# Altium schematic sheet sdram.SchDoc: DDR3 SDRAM
size D; CheckedBy: J. Brinton; CompanyName: Signal Laboratories, Inc.; DrawnBy: J. Brinton; Engineer: J. Brinton; Address1: 3479 Edison Way; Address2: Menlo Park CA 94025; Address3: +1 (877) 778-8435; Address4: siglabs.com; DocumentNumber: 39; Revision: 2b; SheetNumber: 40; SheetTotal: 58
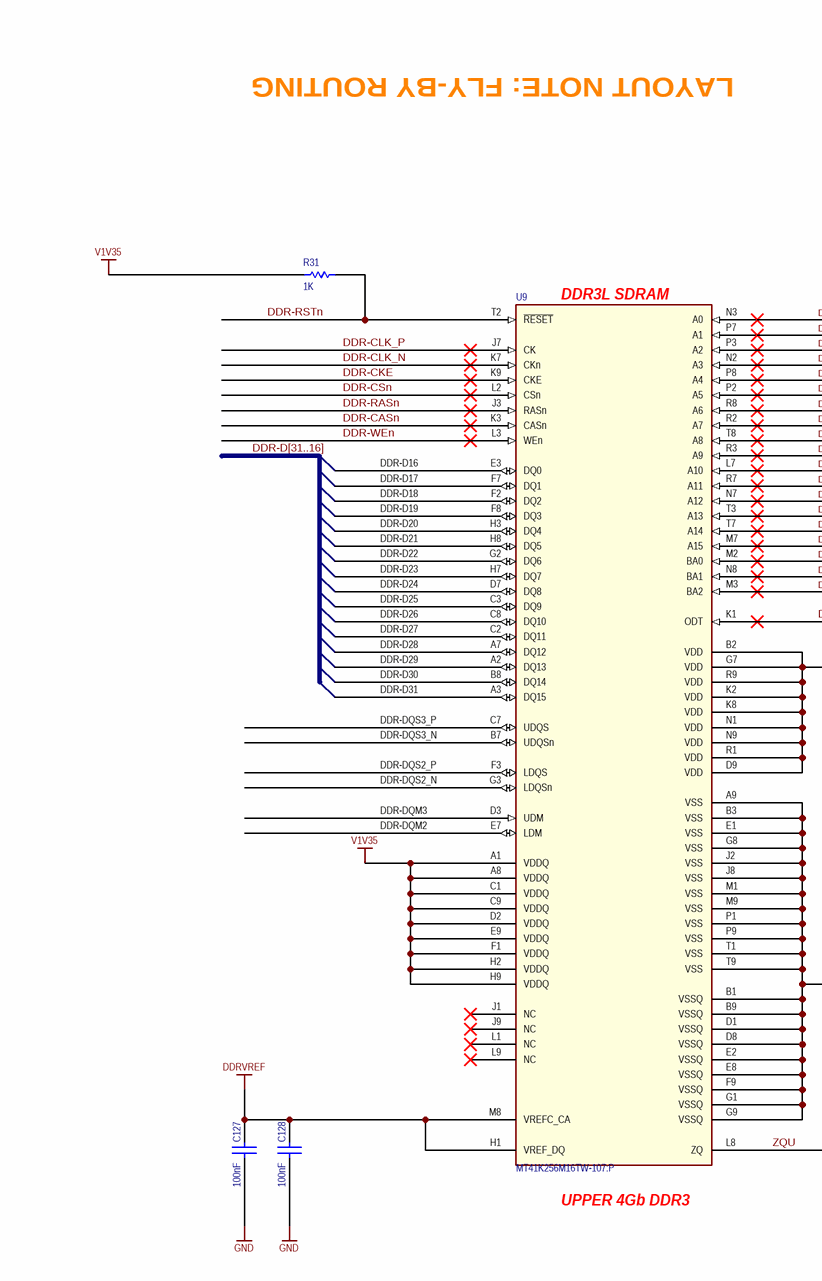
[diagram p0: sdram.SchDoc, top left]
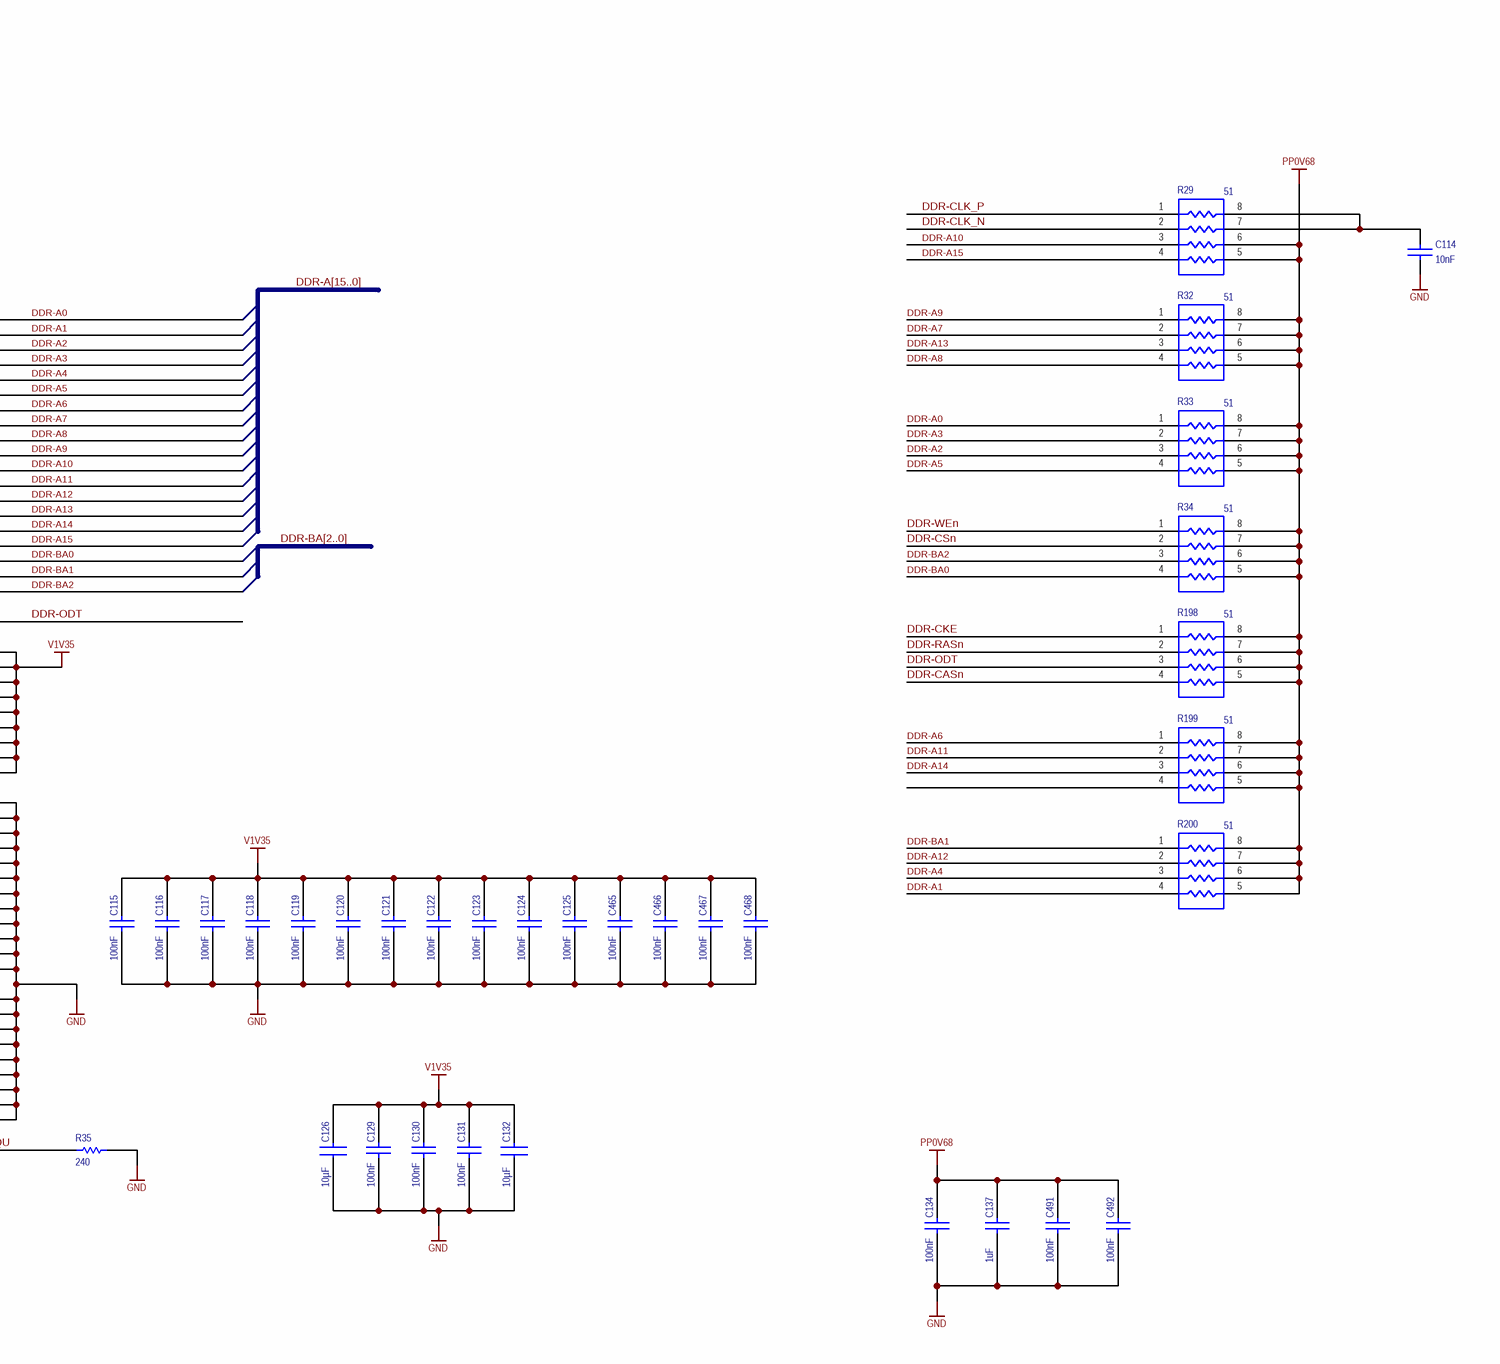
[diagram p1: sdram.SchDoc, top right]
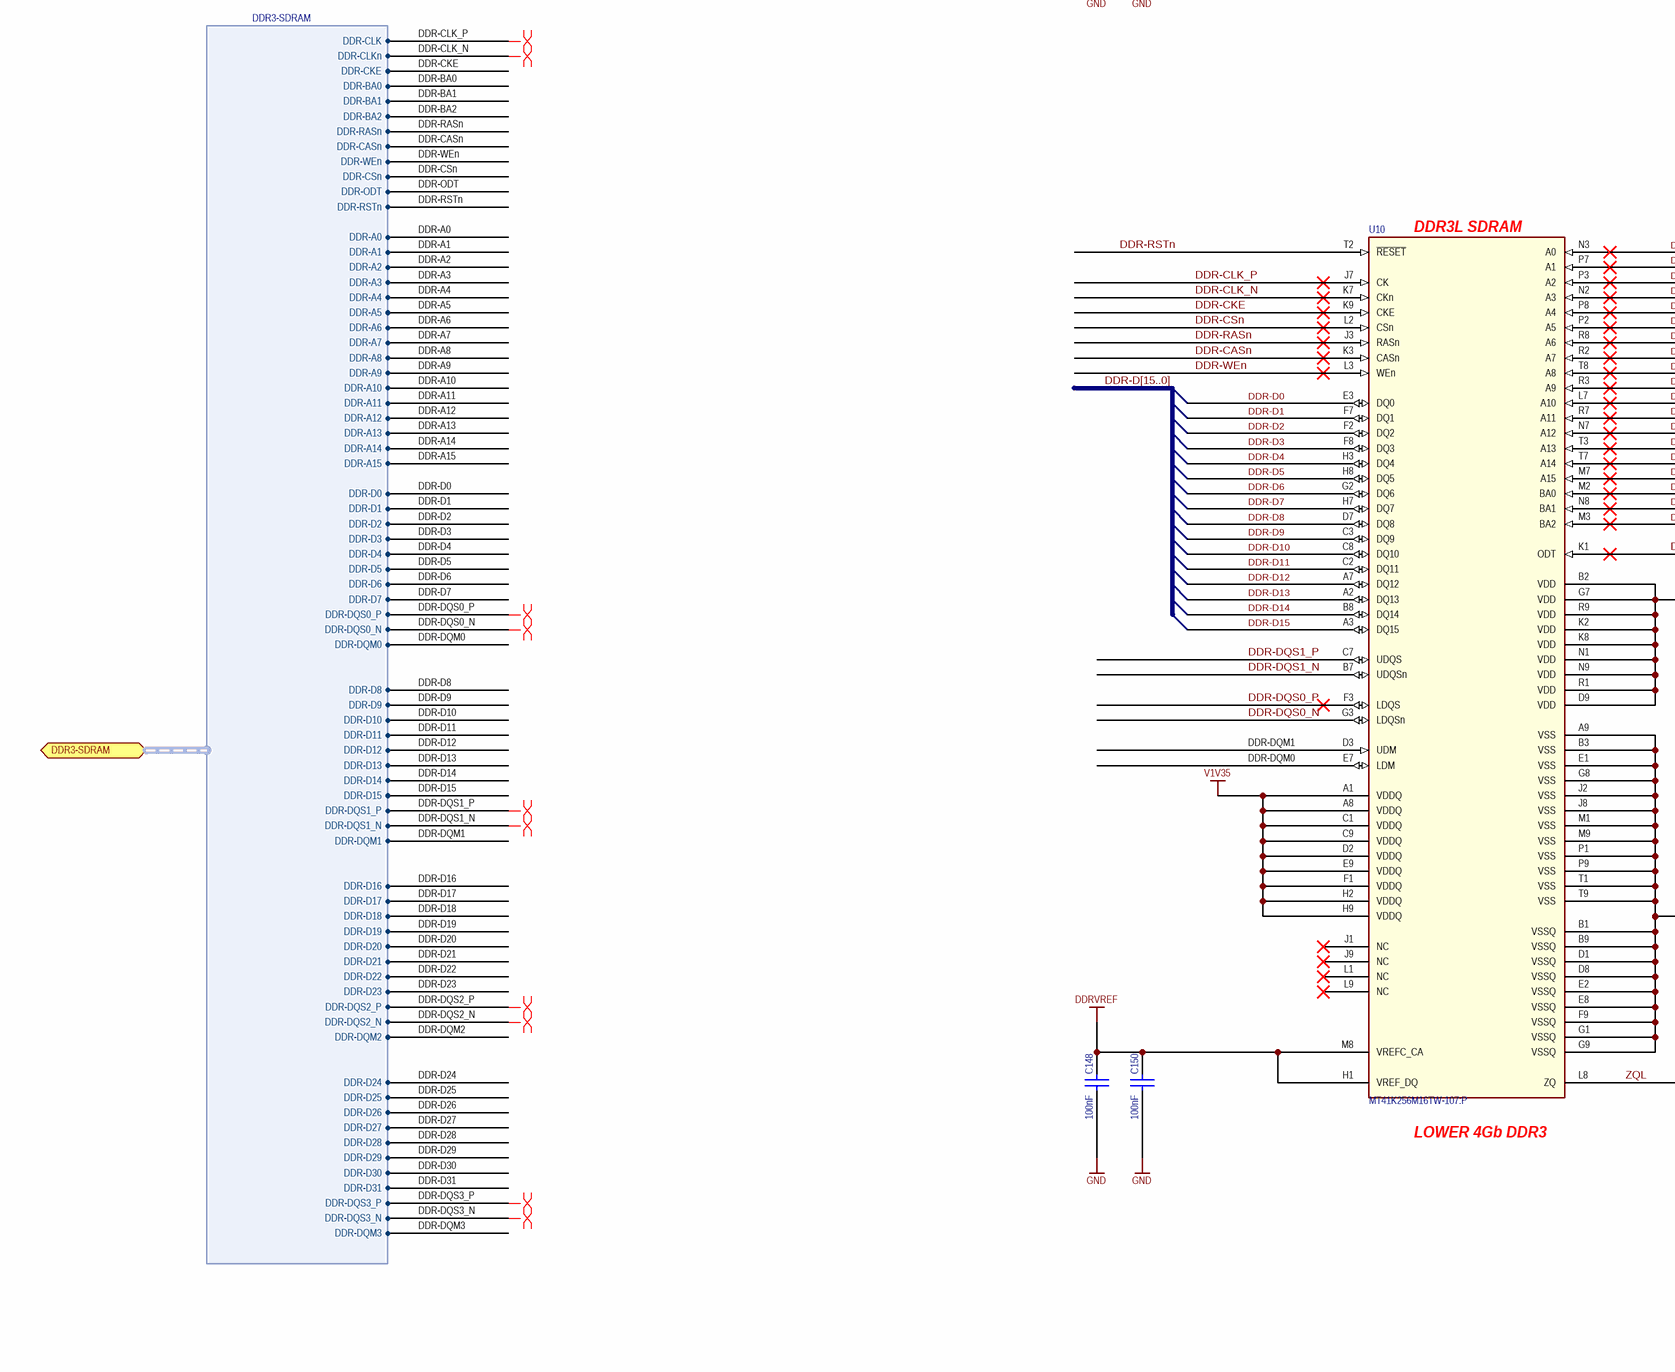
[diagram p2: sdram.SchDoc, bottom left]
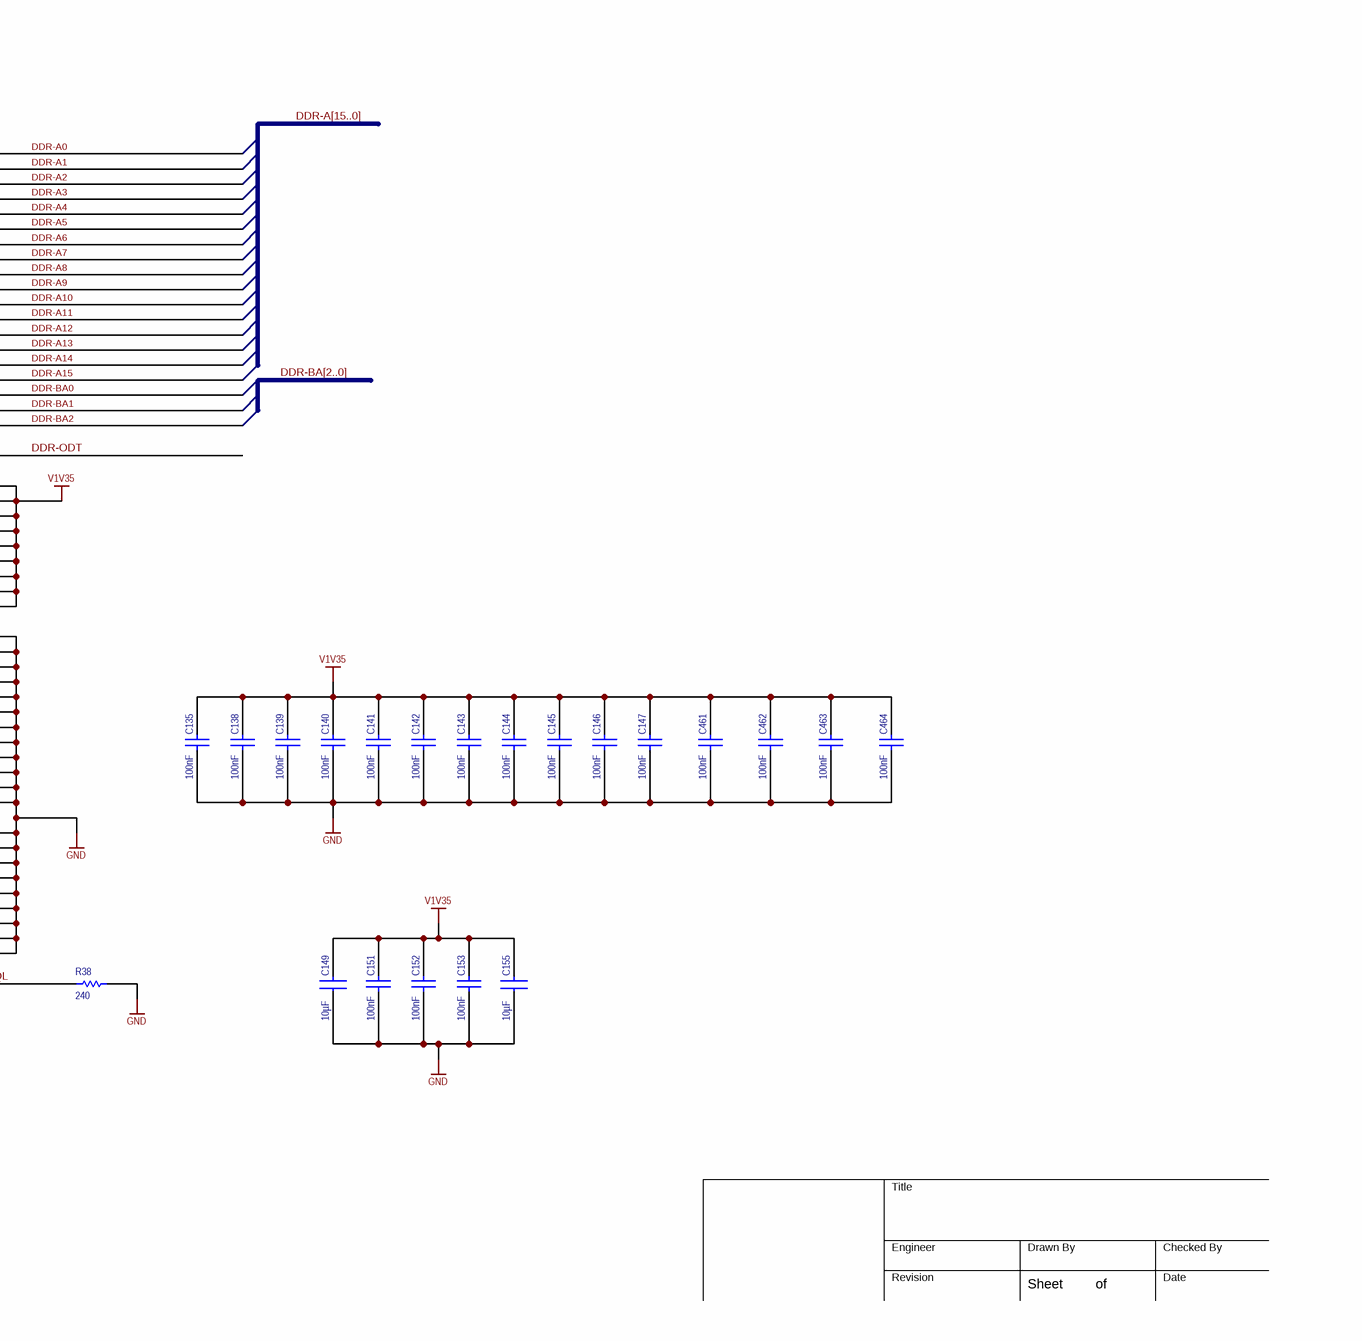
[diagram p3: sdram.SchDoc, bottom right]

## Parts
C114  value 10nF  [0402]  (hidden comment: GRM155R71E103KA01D)
C115  value 100nF  [CAPC1005X56N]  (hidden comment: GRM155R71C104KA88J)
C116  value 100nF  [CAPC1005X56N]  (hidden comment: GRM155R71C104KA88J)
C117  value 100nF  [CAPC1005X56N]  (hidden comment: GRM155R71C104KA88J)
C118  value 100nF  [CAPC1005X56N]  (hidden comment: GRM155R71C104KA88J)
C119  value 100nF  [CAPC1005X56N]  (hidden comment: GRM155R71C104KA88J)
C120  value 100nF  [CAPC1005X56N]  (hidden comment: GRM155R71C104KA88J)
C121  value 100nF  [CAPC1005X56N]  (hidden comment: GRM155R71C104KA88J)
C122  value 100nF  [CAPC1005X56N]  (hidden comment: GRM155R71C104KA88J)
C123  value 100nF  [CAPC1005X56N]  (hidden comment: GRM155R71C104KA88J)
C124  value 100nF  [CAPC1005X56N]  (hidden comment: GRM155R71C104KA88J)
C125  value 100nF  [CAPC1005X56N]  (hidden comment: GRM155R71C104KA88J)
C126  value 10µF  [0603]  (hidden comment: CL10A106MA8NRNC)
C127  value 100nF  [CAPC1005X56N]  (hidden comment: GRM155R71C104KA88J)
C128  value 100nF  [CAPC1005X56N]  (hidden comment: GRM155R71C104KA88J)
C129  value 100nF  [CAPC1005X56N]  (hidden comment: GRM155R71C104KA88J)
C130  value 100nF  [CAPC1005X56N]  (hidden comment: GRM155R71C104KA88J)
C131  value 100nF  [CAPC1005X56N]  (hidden comment: GRM155R71C104KA88J)
C132  value 10µF  [0603]  (hidden comment: CL10A106MA8NRNC)
C134  value 100nF  [CAPC1005X56N]  (hidden comment: GRM155R71C104KA88J)
C135  value 100nF  [CAPC1005X56N]  (hidden comment: GRM155R71C104KA88J)
C137  value 1uF  [CAPC1005X56N]  (hidden comment: GRM155R61A105KE15D)
C138  value 100nF  [CAPC1005X56N]  (hidden comment: GRM155R71C104KA88J)
C139  value 100nF  [CAPC1005X56N]  (hidden comment: GRM155R71C104KA88J)
C140  value 100nF  [CAPC1005X56N]  (hidden comment: GRM155R71C104KA88J)
C141  value 100nF  [CAPC1005X56N]  (hidden comment: GRM155R71C104KA88J)
C142  value 100nF  [CAPC1005X56N]  (hidden comment: GRM155R71C104KA88J)
C143  value 100nF  [CAPC1005X56N]  (hidden comment: GRM155R71C104KA88J)
C144  value 100nF  [CAPC1005X56N]  (hidden comment: GRM155R71C104KA88J)
C145  value 100nF  [CAPC1005X56N]  (hidden comment: GRM155R71C104KA88J)
C146  value 100nF  [CAPC1005X56N]  (hidden comment: GRM155R71C104KA88J)
C147  value 100nF  [CAPC1005X56N]  (hidden comment: GRM155R71C104KA88J)
C148  value 100nF  [CAPC1005X56N]  (hidden comment: GRM155R71C104KA88J)
C149  value 10µF  [0603]  (hidden comment: CL10A106MA8NRNC)
C150  value 100nF  [CAPC1005X56N]  (hidden comment: GRM155R71C104KA88J)
C151  value 100nF  [CAPC1005X56N]  (hidden comment: GRM155R71C104KA88J)
C152  value 100nF  [CAPC1005X56N]  (hidden comment: GRM155R71C104KA88J)
C153  value 100nF  [CAPC1005X56N]  (hidden comment: GRM155R71C104KA88J)
C155  value 10µF  [0603]  (hidden comment: CL10A106MA8NRNC)
C461  value 100nF  [CAPC1005X56N]  (hidden comment: GRM155R71C104KA88J)
C462  value 100nF  [CAPC1005X56N]  (hidden comment: GRM155R71C104KA88J)
C463  value 100nF  [CAPC1005X56N]  (hidden comment: GRM155R71C104KA88J)
C464  value 100nF  [CAPC1005X56N]  (hidden comment: GRM155R71C104KA88J)
C465  value 100nF  [CAPC1005X56N]  (hidden comment: GRM155R71C104KA88J)
C466  value 100nF  [CAPC1005X56N]  (hidden comment: GRM155R71C104KA88J)
C467  value 100nF  [CAPC1005X56N]  (hidden comment: GRM155R71C104KA88J)
C468  value 100nF  [CAPC1005X56N]  (hidden comment: GRM155R71C104KA88J)
C491  value 100nF  [CAPC1005X56N]  (hidden comment: GRM155R71C104KA88J)
C492  value 100nF  [CAPC1005X56N]  (hidden comment: GRM155R71C104KA88J)
R29  value 51  [0804-PAK-8]  (hidden comment: 741C083510JP)
R31  value 1K  [0402]  (hidden comment: RC0402FR-071KL)
R32  value 51  [0804-PAK-8]  (hidden comment: 741C083510JP)
R33  value 51  [0804-PAK-8]  (hidden comment: 741C083510JP)
R34  value 51  [0804-PAK-8]  (hidden comment: 741C083510JP)
R35  value 240  [0402]  (hidden comment: ERJ-2RKF2400X)
R38  value 240  [0402]  (hidden comment: ERJ-2RKF2400X)
R198  value 51  [0804-PAK-8]  (hidden comment: 741C083510JP)
R199  value 51  [0804-PAK-8]  (hidden comment: 741C083510JP)
R200  value 51  [0804-PAK-8]  (hidden comment: 741C083510JP)
U9  MT41K256M16TW-107:P  [BGA96_T9_P8_9X14]
U10  MT41K256M16TW-107:P  [BGA96_T9_P8_9X14]

## Ports
DDR3-SDRAM (harness DDR3-SDRAM)

## Harnesses
DDR3-SDRAM: DDR-CLK, DDR-CLKn, DDR-CKE, DDR-BA0, DDR-BA1, DDR-BA2, DDR-RASn, DDR-CASn, DDR-WEn, DDR-CSn, DDR-ODT, DDR-RSTn, DDR-A0, DDR-A1, DDR-A2, DDR-A3, DDR-A4, DDR-A5, DDR-A6, DDR-A7, DDR-A8, DDR-A9, DDR-A10, DDR-A11, DDR-A12, DDR-A13, DDR-A14, DDR-A15, DDR-D0, DDR-D1, DDR-D2, DDR-D3, DDR-D4, DDR-D5, DDR-D6, DDR-D7, DDR-DQM0, DDR-DQS0_P, DDR-DQS0_N, DDR-D8, DDR-D9, DDR-D10, DDR-D11, DDR-D12, DDR-D13, DDR-D14, DDR-D15, DDR-DQM1, DDR-DQS1_P, DDR-DQS1_N, DDR-D16, DDR-D17, DDR-D18, DDR-D19, DDR-D20, DDR-D21, DDR-D22, DDR-D23, DDR-DQM2, DDR-DQS2_P, DDR-DQS2_N, DDR-D24, DDR-D25, DDR-D26, DDR-D27, DDR-D28, DDR-D29, DDR-D30, DDR-D31, DDR-DQM3, DDR-DQS3_P, DDR-DQS3_N

## Nets
DDRVREF: C127.2 C128.2 C148.2 C150.2 U9.H1(VREF_DQ) U9.M8(VREFC_CA) U10.H1(VREF_DQ) U10.M8(VREFC_CA)
GND: C114.1 C115.1 C116.1 C117.1 C118.1 C119.1 C120.1 C121.1 C122.1 C123.1 C124.1 C125.1 C126.1 C127.1 C128.1 C129.1 C130.1 C131.1 C132.1 C134.1 C135.1 C137.1 C138.1 C139.1 C140.1 C141.1 C142.1 C143.1 C144.1 C145.1 C146.1 C147.1 C148.1 C149.1 C150.1 C151.1 C152.1 C153.1 C155.1 C461.1 C462.1 C463.1 C464.1 C465.1 C466.1 C467.1 C468.1 C491.1 C492.1 R35.2 R38.2 U9.A9(VSS) U9.B1(VSSQ) U9.B3(VSS) U9.B9(VSSQ) U9.D1(VSSQ) U9.D8(VSSQ) U9.E1(VSS) U9.E2(VSSQ) U9.E8(VSSQ) U9.F9(VSSQ) U9.G1(VSSQ) U9.G8(VSS) U9.G9(VSSQ) U9.J2(VSS) U9.J8(VSS) U9.M1(VSS) U9.M9(VSS) U9.P1(VSS) U9.P9(VSS) U9.T1(VSS) U9.T9(VSS) U10.A9(VSS) U10.B1(VSSQ) U10.B3(VSS) U10.B9(VSSQ) U10.D1(VSSQ) U10.D8(VSSQ) U10.E1(VSS) U10.E2(VSSQ) U10.E8(VSSQ) U10.F9(VSSQ) U10.G1(VSSQ) U10.G8(VSS) U10.G9(VSSQ) U10.J2(VSS) U10.J8(VSS) U10.M1(VSS) U10.M9(VSS) U10.P1(VSS) U10.P9(VSS) U10.T1(VSS) U10.T9(VSS)
PP0V68: C134.2 C137.2 C491.2 C492.2 R29.5 R29.6 R32.5 R32.6 R32.7 R32.8 R33.5 R33.6 R33.7 R33.8 R34.5 R34.6 R34.7 R34.8 R198.5 R198.6 R198.7 R198.8 R199.5 R199.6 R199.7 R199.8 R200.5 R200.6 R200.7 R200.8
V1V35: C115.2 C116.2 C117.2 C118.2 C119.2 C120.2 C121.2 C122.2 C123.2 C124.2 C125.2 C126.2 C129.2 C130.2 C131.2 C132.2 C135.2 C138.2 C139.2 C140.2 C141.2 C142.2 C143.2 C144.2 C145.2 C146.2 C147.2 C149.2 C151.2 C152.2 C153.2 C155.2 C461.2 C462.2 C463.2 C464.2 C465.2 C466.2 C467.2 C468.2 R31.1 U9.A1(VDDQ) U9.A8(VDDQ) U9.B2(VDD) U9.C1(VDDQ) U9.C9(VDDQ) U9.D2(VDDQ) U9.D9(VDD) U9.E9(VDDQ) U9.F1(VDDQ) U9.G7(VDD) U9.H2(VDDQ) U9.H9(VDDQ) U9.K2(VDD) U9.K8(VDD) U9.N1(VDD) U9.N9(VDD) U9.R1(VDD) U9.R9(VDD) U10.A1(VDDQ) U10.A8(VDDQ) U10.B2(VDD) U10.C1(VDDQ) U10.C9(VDDQ) U10.D2(VDDQ) U10.D9(VDD) U10.E9(VDDQ) U10.F1(VDDQ) U10.G7(VDD) U10.H2(VDDQ) U10.H9(VDDQ) U10.K2(VDD) U10.K8(VDD) U10.N1(VDD) U10.N9(VDD) U10.R1(VDD) U10.R9(VDD)
DDR-A0: R33.1 U9.N3(A0) U10.N3(A0) ; port DDR3-SDRAM.DDR-A0
DDR-A1: R200.4 U9.P7(A1) U10.P7(A1) ; port DDR3-SDRAM.DDR-A1
DDR-A2: R33.3 U9.P3(A2) U10.P3(A2) ; port DDR3-SDRAM.DDR-A2
DDR-A3: R33.2 U9.N2(A3) U10.N2(A3) ; port DDR3-SDRAM.DDR-A3
DDR-A4: R200.3 U9.P8(A4) U10.P8(A4) ; port DDR3-SDRAM.DDR-A4
DDR-A5: R33.4 U9.P2(A5) U10.P2(A5) ; port DDR3-SDRAM.DDR-A5
DDR-A6: R199.1 U9.R8(A6) U10.R8(A6) ; port DDR3-SDRAM.DDR-A6
DDR-A7: R32.2 U9.R2(A7) U10.R2(A7) ; port DDR3-SDRAM.DDR-A7
DDR-A8: R32.4 U9.T8(A8) U10.T8(A8) ; port DDR3-SDRAM.DDR-A8
DDR-A9: R32.1 U9.R3(A9) U10.R3(A9) ; port DDR3-SDRAM.DDR-A9
DDR-A10: R29.3 U9.L7(A10) U10.L7(A10) ; port DDR3-SDRAM.DDR-A10
DDR-A11: R199.2 U9.R7(A11) U10.R7(A11) ; port DDR3-SDRAM.DDR-A11
DDR-A12: R200.2 U9.N7(A12) U10.N7(A12) ; port DDR3-SDRAM.DDR-A12
DDR-A13: R32.3 U9.T3(A13) U10.T3(A13) ; port DDR3-SDRAM.DDR-A13
DDR-A14: R199.3 U9.T7(A14) U10.T7(A14) ; port DDR3-SDRAM.DDR-A14
DDR-A15: R29.4 U9.M7(A15) U10.M7(A15) ; port DDR3-SDRAM.DDR-A15
DDR-BA0: R34.4 U9.M2(BA0) U10.M2(BA0) ; port DDR3-SDRAM.DDR-BA0
DDR-BA1: R200.1 U9.N8(BA1) U10.N8(BA1) ; port DDR3-SDRAM.DDR-BA1
DDR-BA2: R34.3 U9.M3(BA2) U10.M3(BA2) ; port DDR3-SDRAM.DDR-BA2
DDR-CASn: R198.4 U9.K3(CASn) U10.K3(CASn) ; port DDR3-SDRAM.DDR-CASn
DDR-CKE: R198.1 U9.K9(CKE) U10.K9(CKE) ; port DDR3-SDRAM.DDR-CKE
DDR-CLK_N: R29.2 U9.K7(CKn) U10.K7(CKn) ; port DDR3-SDRAM.DDR-CLKn
DDR-CLK_P: R29.1 U9.J7(CK) U10.J7(CK) ; port DDR3-SDRAM.DDR-CLK
DDR-CSn: R34.2 U9.L2(CSn) U10.L2(CSn) ; port DDR3-SDRAM.DDR-CSn
DDR-D0: U10.E3(DQ0) ; port DDR3-SDRAM.DDR-D0
DDR-D1: U10.F7(DQ1) ; port DDR3-SDRAM.DDR-D1
DDR-D2: U10.F2(DQ2) ; port DDR3-SDRAM.DDR-D2
DDR-D3: U10.F8(DQ3) ; port DDR3-SDRAM.DDR-D3
DDR-D4: U10.H3(DQ4) ; port DDR3-SDRAM.DDR-D4
DDR-D5: U10.H8(DQ5) ; port DDR3-SDRAM.DDR-D5
DDR-D6: U10.G2(DQ6) ; port DDR3-SDRAM.DDR-D6
DDR-D7: U10.H7(DQ7) ; port DDR3-SDRAM.DDR-D7
DDR-D8: U10.D7(DQ8) ; port DDR3-SDRAM.DDR-D8
DDR-D9: U10.C3(DQ9) ; port DDR3-SDRAM.DDR-D9
DDR-D10: U10.C8(DQ10) ; port DDR3-SDRAM.DDR-D10
DDR-D11: U10.C2(DQ11) ; port DDR3-SDRAM.DDR-D11
DDR-D12: U10.A7(DQ12) ; port DDR3-SDRAM.DDR-D12
DDR-D13: U10.A2(DQ13) ; port DDR3-SDRAM.DDR-D13
DDR-D14: U10.B8(DQ14) ; port DDR3-SDRAM.DDR-D14
DDR-D15: U10.A3(DQ15) ; port DDR3-SDRAM.DDR-D15
DDR-D16: U9.E3(DQ0) ; port DDR3-SDRAM.DDR-D16
DDR-D17: U9.F7(DQ1) ; port DDR3-SDRAM.DDR-D17
DDR-D18: U9.F2(DQ2) ; port DDR3-SDRAM.DDR-D18
DDR-D19: U9.F8(DQ3) ; port DDR3-SDRAM.DDR-D19
DDR-D20: U9.H3(DQ4) ; port DDR3-SDRAM.DDR-D20
DDR-D21: U9.H8(DQ5) ; port DDR3-SDRAM.DDR-D21
DDR-D22: U9.G2(DQ6) ; port DDR3-SDRAM.DDR-D22
DDR-D23: U9.H7(DQ7) ; port DDR3-SDRAM.DDR-D23
DDR-D24: U9.D7(DQ8) ; port DDR3-SDRAM.DDR-D24
DDR-D25: U9.C3(DQ9) ; port DDR3-SDRAM.DDR-D25
DDR-D26: U9.C8(DQ10) ; port DDR3-SDRAM.DDR-D26
DDR-D27: U9.C2(DQ11) ; port DDR3-SDRAM.DDR-D27
DDR-D28: U9.A7(DQ12) ; port DDR3-SDRAM.DDR-D28
DDR-D29: U9.A2(DQ13) ; port DDR3-SDRAM.DDR-D29
DDR-D30: U9.B8(DQ14) ; port DDR3-SDRAM.DDR-D30
DDR-D31: U9.A3(DQ15) ; port DDR3-SDRAM.DDR-D31
DDR-DQM0: U10.E7(LDM) ; port DDR3-SDRAM.DDR-DQM0
DDR-DQM1: U10.D3(UDM) ; port DDR3-SDRAM.DDR-DQM1
DDR-DQM2: U9.E7(LDM) ; port DDR3-SDRAM.DDR-DQM2
DDR-DQM3: U9.D3(UDM) ; port DDR3-SDRAM.DDR-DQM3
DDR-DQS0_N: U10.G3(LDQSn) ; port DDR3-SDRAM.DDR-DQS0_N
DDR-DQS0_P: U10.F3(LDQS) ; port DDR3-SDRAM.DDR-DQS0_P
DDR-DQS1_N: U10.B7(UDQSn) ; port DDR3-SDRAM.DDR-DQS1_N
DDR-DQS1_P: U10.C7(UDQS) ; port DDR3-SDRAM.DDR-DQS1_P
DDR-DQS2_N: U9.G3(LDQSn) ; port DDR3-SDRAM.DDR-DQS2_N
DDR-DQS2_P: U9.F3(LDQS) ; port DDR3-SDRAM.DDR-DQS2_P
DDR-DQS3_N: U9.B7(UDQSn) ; port DDR3-SDRAM.DDR-DQS3_N
DDR-DQS3_P: U9.C7(UDQS) ; port DDR3-SDRAM.DDR-DQS3_P
DDR-ODT: R198.3 U9.K1(ODT) U10.K1(ODT) ; port DDR3-SDRAM.DDR-ODT
DDR-RASn: R198.2 U9.J3(RASn) U10.J3(RASn) ; port DDR3-SDRAM.DDR-RASn
DDR-RSTn: R31.2 U9.T2(~{RESET}) U10.T2(~{RESET}) ; port DDR3-SDRAM.DDR-RSTn
DDR-WEn: R34.1 U9.L3(WEn) U10.L3(WEn) ; port DDR3-SDRAM.DDR-WEn
ZQL: R38.1 U10.L8(ZQ)
ZQU: R35.1 U9.L8(ZQ)
NetC114_2: C114.2 R29.7 R29.8

Not connected (* = marked no-connect by the designer): R199 4; U9 J1(NC)* J9(NC)* L1(NC)* L9(NC)*; U10 J1(NC)* J9(NC)* L1(NC)* L9(NC)*

## Buses and harness runs
bus DDR-A[15..0]
bus DDR-BA[2..0]
bus DDR-D[15..0]
bus DDR-D[31..16]

## Layout directives
differential pair: DDR-CLK_N, DDR-CLK_P, DDR-DQS0_N, DDR-DQS0_P, DDR-DQS1_N, DDR-DQS1_P, DDR-DQS2_N, DDR-DQS2_P, DDR-DQS3_N, DDR-DQS3_P

## Notes on the sheet
- LAYOUT NOTE: FLY-BY ROUTING
- (near U9) DDR3L SDRAM
- (near U9) UPPER 4Gb DDR3
- (near U10) DDR3L SDRAM
- (near U10) LOWER 4Gb DDR3
- Title
- Engineer
- Revision
- Drawn By
- Sheet
- of
- Checked By
- Date

## Library data of the parts
C114 = CAP 0402: Ceramic Capacitor 10nF ±10% 25V X7R 0402; Manufacturer: Murata; Tr: -55:125; Voltage: 25V; Manufacturer P/N: GRM155R71E103KA01D; Package: 0402; Tolerance: ±10%
C115-C125 C127-C131 C134 C135 C138-C148 C150-C153 C461-C468 C491 C492 = GRM155R71A104KA01J: Ceramic Capacitor 100nF ±10% 16V X7R 0402; Manufacturer: Murata; Tr: -55:125; Manufacturer P/N: GRM155R71C104KA88J; Tolerance: ±10%; Package: 0402; Voltage: 16V
C126 C132 C149 C155 = CAP_4.7uF_X5R_6.3V_10%_0603: Ceramic Capacitor 10uF ±20% 25V X5R 0603; Manufacturer: Samsung; Tr: -55:85; Tolerance: ±20%; Manufacturer P/N: CL10A106MA8NRNC; Package: 0603; Voltage: 25V
C137 = CAP 0402: Ceramic Capacitor 1uF ±10% 10V X5R 0402; Manufacturer: Murata; Tr: -55:125; Voltage: 10V; Manufacturer P/N: GRM155R61A105KE15D; Package: 0402; Tolerance: ±10%
R29 R32-R34 R198-R200 = RESPAK x4 0804: 4 Resistor Array 51 ±5% 0804; Manufacturer: CTS; Tr: -55:125; Manufacturer P/N: 741C083510JP; Package: 0804; Tolerance: ±5%
R31 = RES 0402: Thick Film Resistor 1k ±1% 0402; Manufacturer: Yageo; Tr: -55:155; Package: 0402; Manufacturer P/N: RC0402FR-071KL; Tolerance: ±1%
R35 R38 = RES 0402: Thick Film Resistor 240 ±1% 0402; Manufacturer: Panasonic; Tr: -55:155; Package: 0402; Manufacturer P/N: ERJ-2RKF2400X; Tolerance: ±1%
U9 U10 = MT41K256M16HA: DDR2 SDRAM 2Gb (256Mx8); Manufacturer: Micron Technology; Manufacturer P/N: MT41K256M16TW-107:P